# EAGLE design Remote Control v1 (EAGLE 6.5.0)
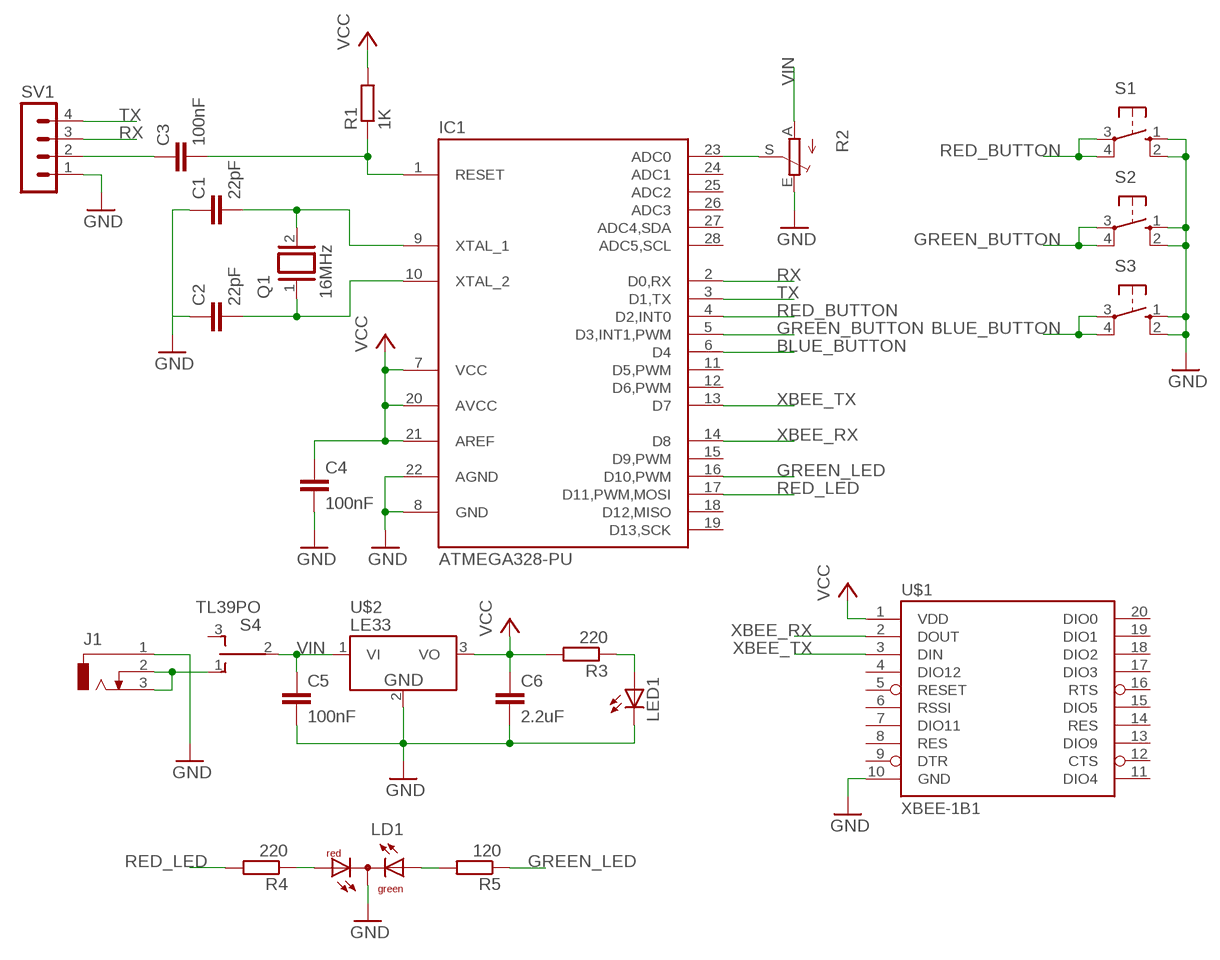
[diagram p0: schematic, sheet 1]

## Parts
C1  22pF  C-EU050-024X044  [C050-024X044]
C2  22pF  C-EU050-024X044  [C050-024X044]
C3  100nF  C-EU050-025X075  [C050-025X075]
C4  100nF  C-EU050-025X075  [C050-025X075]
C5  100nF  C-EU050-025X075  [C050-025X075]
C6  2.2uF  C-EU050-035X075  [C050-035X075]
IC1  ATMEGA328-PU  [DIL28-3]
J1  DCJ0303  [DCJ0303]
LD1  DUOLED-RG-C  [DUOLED-C-5MM]
LED1  LED3MM  [LED3MM]
Q1  16MHz  XTAL/S  [QS]
R1  1K  R-EU_0207/7  [0207/7]
R2  TRIM_EU-CA9V  [CA9V]
R3  220  R-EU_0207/7  [0207/7]
R4  220  R-EU_0207/7  [0207/7]
R5  120  R-EU_0207/7  [0207/7]
S1  40-XX  [B3F-40XX]
S2  40-XX  [B3F-40XX]
S3  40-XX  [B3F-40XX]
S4  TL39PO  [TL3XPO]
SV1  MA04-1  [MA04-1]
U$1  XBEE-1B1  [XBEE-1]
U$2  LE33  [TO-92]

## Nets
BLUE_BUTTON: IC1.6(D4) S3.3(P) S3.4(P1)
GND: C1.1 C2.1 C4.2 C5.2 C6.2 IC1.8(GND) IC1.22(AGND) J1.1 LD1.C LED1.K(C) R2.E S1.1(S) S1.2(S1) S2.1(S) S2.2(S1) S3.1(S) S3.2(S1) SV1.1 U$1.10(GND) U$2.2(GND)
GREEN_BUTTON: IC1.5(D3,INT1,PWM) S2.3(P) S2.4(P1)
GREEN_LED: IC1.16(D10,PWM) R5.1
N$1: C1.2 IC1.9(XTAL_1) Q1.2
N$2: C2.2 IC1.10(XTAL_2) Q1.1
N$3: J1.2 J1.3 S4.1(O)
N$5: C3.2 IC1.1(RESET) R1.1
N$6: C3.1 SV1.2
N$9: IC1.23(ADC0) R2.S
N$10: LED1.A R3.1
N$11: LD1.AR R4.1
N$12: LD1.AX(AG) R5.2
RED_BUTTON: IC1.4(D2,INT0) S1.3(P) S1.4(P1)
RED_LED: IC1.17(D11,PWM,MOSI) R4.2
RX: IC1.2(D0,RX) SV1.3
TX: IC1.3(D1,TX) SV1.4
VCC: C4.1 C6.1 IC1.7(VCC) IC1.20(AVCC) IC1.21(AREF) R1.2 R3.2 U$1.1(VDD) U$2.3(VO)
VIN: C5.1 R2.A S4.2(P) U$2.1(VI)
XBEE_RX: IC1.14(D8) U$1.2(DOUT)
XBEE_TX: IC1.13(D7) U$1.3(DIN)
Unconnected: IC1.11(D5,PWM) IC1.12(D6,PWM) IC1.15(D9,PWM) IC1.18(D12,MISO) IC1.19(D13,SCK) IC1.24(ADC1) IC1.25(ADC2) IC1.26(ADC3) IC1.27(ADC4,SDA) IC1.28(ADC5,SCL) S4.3(S) U$1.4(DIO12) U$1.5(RESET) U$1.6(RSSI) U$1.7(DIO11) U$1.8(RES) U$1.9(DTR) U$1.11(DIO4) U$1.12(CTS) U$1.13(DIO9) U$1.14(RES) U$1.15(DIO5) U$1.16(RTS) U$1.17(DIO3) U$1.18(DIO2) U$1.19(DIO1) U$1.20(DIO0)

## Library data of the parts
C1-C6 = resistor:C-EU: CAPACITOR, European symbol
IC1 = Arduino:ATMEGA328-PU
J1 = con-jack:DCJ0303: DC POWER JACK Source: DCJ0303.pdf; OC_FARNELL: unknown; OC_NEWARK: unknown
LD1 = led:DUOLED-RG-C: DUO LED 2 colors (red/green), 5 mm, round, common Cathode www.ligitek.com or other producers.
LED1 = led:LED: LED OSRAM: - CHIPLED LG R971, LG N971, LY N971, LG Q971, LY Q971, LO R971, LY R971 LH N974, LH R974 LS Q976, LO Q976, LY Q976 LO Q996 - Hyper CHIPLED LW Q18S LB Q993, LB Q99A, LB R99A - SideLED LS A670, LO A670, LY A670, LG A670, LP A670 LB A673, LV A673, LT A673, LW A673 LH A674 LY A675 LS A676, LA A676, LO A676, LY A676, LW A676 LS A679, LY A679, LG A679 - Hyper Micro SIDELED® LS Y876, LA Y876, LO Y876, LY Y876 LT Y87S - SmartLED LW L88C, LW L88S LB L89C, LB L89S, LG L890 LS L89K, LO L89K, LY L89K LS L896, LA L896, LO L896, LY L896 - TOPLED LS T670, LO T670, LY T670, LG T670, LP T670 LSG T670, LSP T670, LSY T670, LOP T670, LYG T670 LG T671, LOG T671, LSG T671 LB T673, LV T673, LT T673, LW T673 LH T674 LS T676, LA T676, LO T676, LY T676, LB T676, LH T676, LSB T676, LW T676 LB T67C, LV T67C, LT T67C, LS T67K, LO T67K, LY T67K, LW E67C LS E67B, LA E67B, LO E67B, LY E67B, LB E67C, LV E67C, LT E67C LW T67C LS T679, LY T679, LG T679 LS T770, LO T770, LY T770, LG T770, LP T770 LB T773, LV T773, LT T773, LW T773 LH T774 LS E675, LA E675, LY E675, LS T675 LS T776, LA T776, LO T776, LY T776, LB T776 LHGB T686 LT T68C, LB T68C - Hyper Mini TOPLED® LB M676 - Mini TOPLED Santana® LG M470 LS M47K, LO M47K, LY M47K Source: http://www.osram.convergy.de LUXEON: - LUMILED® LXK2-PW12-R00, LXK2-PW12-S00, LXK2-PW14-U00, LXK2-PW14-V00 LXK2-PM12-R00, LXK2-PM12-S00, LXK2-PM14-U00 LXK2-PE12-Q00, LXK2-PE12-R00, LXK2-PE12-S00, LXK2-PE14-T00, LXK2-PE14-U00 LXK2-PB12-K00, LXK2-PB12-L00, LXK2-PB12-M00, LXK2-PB14-N00, LXK2-PB14-P00, LXK2-PB14-Q00 LXK2-PR12-L00, LXK2-PR12-M00, LXK2-PR14-Q00, LXK2-PR14-R00 LXK2-PD12-Q00, LXK2-PD12-R00, LXK2-PD12-S00 LXK2-PH12-R00, LXK2-PH12-S00 LXK2-PL12-P00, LXK2-PL12-Q00, LXK2-PL12-R00 Source: www.luxeon.com KINGBRIGHT: KA-3528ASYC Source: www.kingbright.com
Q1 = special:XTAL/S: CRYSTAL
R1 R3-R5 = resistor:R-EU_: RESISTOR, European symbol
R2 = pot:TRIM_EU-: POTENTIOMETER
S1-S3 = switch-omron:40-XX: OMRON SWITCH; MF: OMRON COMPONENTS USA; MPN: B3F-4000; OC_FARNELL: 176434; OC_NEWARK: 36K3105
S4 = switch:TL39PO: TINY SWITCH ON OFF ON Source: http://www2.produktinfo.conrad.com/datenblaetter/700000-724999/705152-da-01-de-Subminiaturschalter_TL_36YO.pdf
SV1 = con-lstb:MA04-1: PIN HEADER; OC_FARNELL: unknown; OC_NEWARK: unknown
U$1 = Xbee:XBEE-1: Xbee module footprints SMT header is CONN-09042.
U$2 = Regulator:LE33

## Board
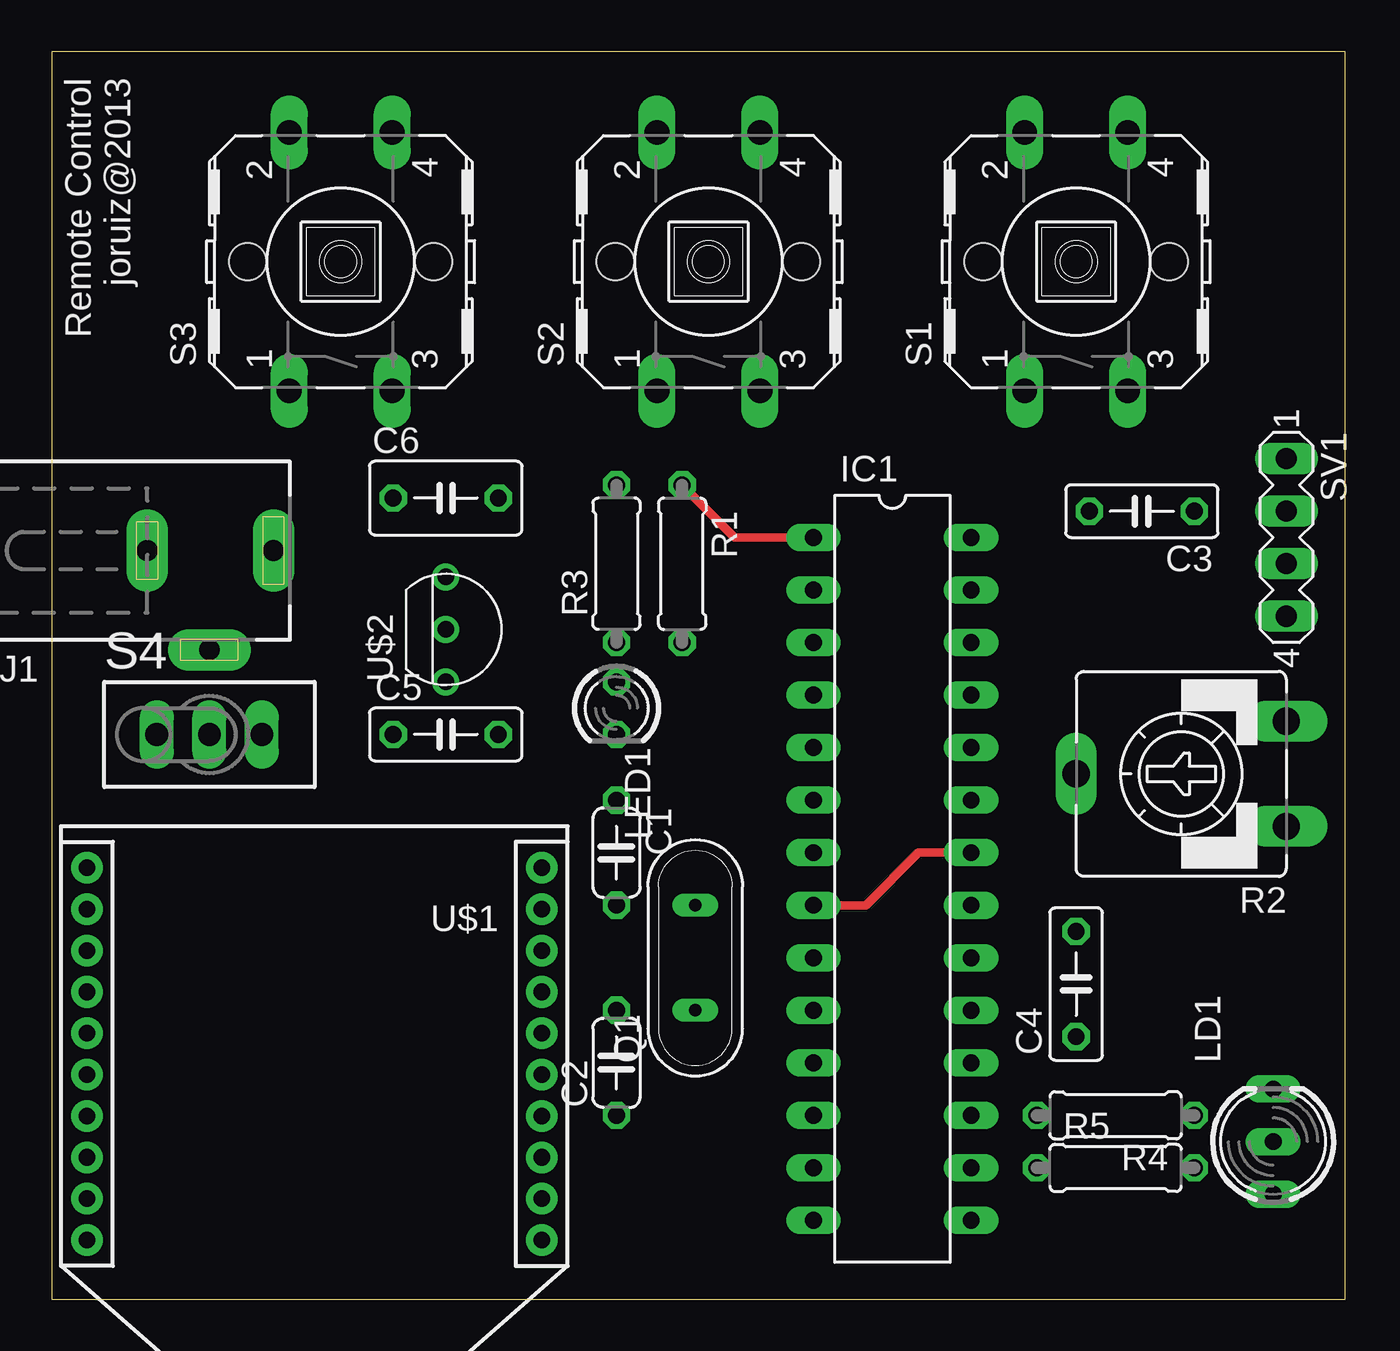
[diagram p1: board, top side]
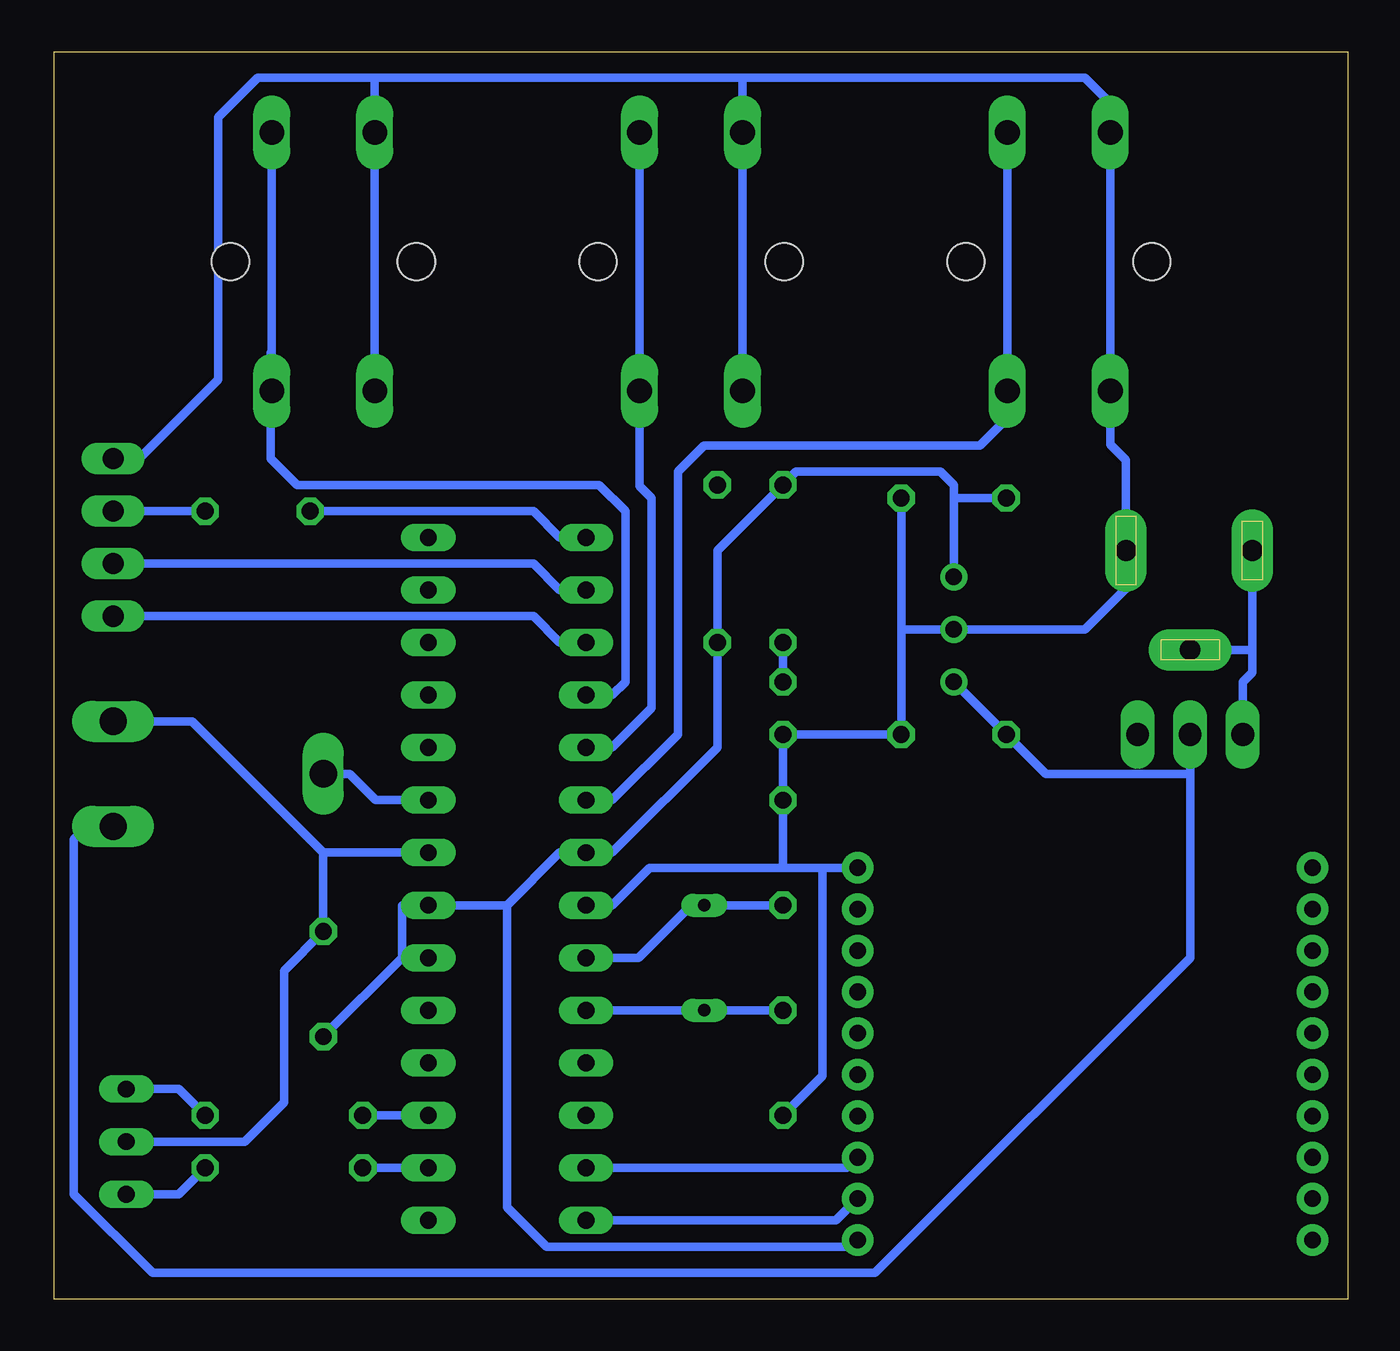
[diagram p2: board, bottom side, seen from below]

Size 62.53 x 60.31 mm. Coordinates in mm from the lower left corner, seen from the top.
Outline: 0,0 62.53,0 62.53,60.31 0,60.31 0,0
Copper layers (1*16): Top 0.035mm / dielectric 1.5mm / Bottom 0.035mm
Design rules "default": minimum track width 10mil, minimum drill 24mil, track to track 8mil, track to pad 8mil, pad to pad 8mil, via to via 8mil, smd to smd 8mil, copper to edge 40mil, drill to drill 8mil, minimum pad ring 10mil, minimum via ring 8mil, stop-mask expansion 4mil, vias tented up to drill 0mil, thermal gap 10mil

### Footprints (pad centres in the part's own frame; a part is rotated, then mirrored left to right if it is on the bottom)
C050-024X044 = drill 0.813 octagon: 1 -2.54,0; 2 2.54,0
C050-025X075 = drill 0.813 octagon: 1 -2.54,0; 2 2.54,0
C050-035X075 = drill 0.813 octagon: 1 -2.54,0; 2 2.54,0
DIL28-3 = drill 0.813 long: 1 -16.51,-3.81; 2 -13.97,-3.81; 3 -11.43,-3.81; 4 -8.89,-3.81; 5 -6.35,-3.81; 6 -3.81,-3.81; 7 -1.27,-3.81; 8 1.27,-3.81; 9 3.81,-3.81; 10 6.35,-3.81; 11 8.89,-3.81; 12 11.43,-3.81; 13 13.97,-3.81; 14 16.51,-3.81; 15 16.51,3.81; 16 13.97,3.81; 17 11.43,3.81; 18 8.89,3.81; 19 6.35,3.81; 20 3.81,3.81; 21 1.27,3.81; 22 -1.27,3.81; 23 -3.81,3.81; 24 -6.35,3.81; 25 -8.89,3.81; 26 -11.43,3.81; 27 -13.97,3.81; 28 -16.51,3.81
DCJ0303 = drill 1 pad 2 long: 1 0,3.1; 2 4.8,0; 3 0,-3
DUOLED-C-5MM = drill 0.813 long: AR 2.54,0; AX -2.54,0; C 0,0
LED3MM = drill 0.813 octagon: A -1.27,0; K 1.27,0
QS = drill 0.61 long: 1 -2.54,0; 2 2.54,0
0207/7 = drill 0.813 octagon: 1 -3.81,0; 2 3.81,0
CA9V = drill 1.321 long: A -2.54,-5.08; E 2.54,-5.08; S 0,5.08
B3F-40XX = drill 1.194 long: 1 -6.248,2.489; 2 6.248,2.489; 3 -6.248,-2.489; 4 6.248,-2.489 | hole 1.803: 0,-4.496; 0,4.496
TL3XPO = drill 1.1 pad 1.422 long: 1 -2.54,0; 2 0,0; 3 2.54,0
MA04-1 = drill 1.016 long: 1 -3.81,0; 2 -1.27,0; 3 1.27,0; 4 3.81,0
XBEE-1 = drill 0.8 pad 1.524: 1 -11,20; 2 -11,18; 3 -11,16; 4 -11,14; 5 -11,12; 6 -11,10; 7 -11,8; 8 -11,6; 9 -11,4; 10 -11,2; 11 11,2; 12 11,4; 13 11,6; 14 11,8; 15 11,10; 16 11,12; 17 11,14; 18 11,16; 19 11,18; 20 11,20
TO-92 = drill 0.8: 1 -2.54,0; 2 0,0; 3 2.54,0

### Placement (x,y rotation side)
C1  27.3,21.59 270 top
C2  27.3,11.43 90 top
C3  52.7,38.1 180 top
C4  49.53,15.24 90 top
C5  19.05,27.3 0 top
C6  19.05,38.73 0 top
IC1  40.64,20.32 270 top
J1  7.62,36.2 270 top
LD1  59.05,7.62 90 top
LED1  27.3,28.57 270 top
Q1  31.11,16.51 90 top
R1  30.48,35.56 270 top
R2  54.61,25.4 90 top
R3  27.3,35.56 90 top
R4  51.44,8.89 180 top
R5  51.44,6.35 0 top
S1  49.53,50.16 90 top
S2  31.75,50.16 90 top
S3  13.97,50.16 90 top
S4  7.62,27.3 0 top
SV1  59.69,36.83 270 top
U$1  12.7,22.86 180 top
U$2  19.05,32.38 90 top

### Tracks (layer width: path | path; a pad name or v marks a point on that pad's centre or on a via)
BLUE_BUTTON
  Bottom 0.406: IC1.6 35.56,24.13 32.38,27.3 32.38,40.01 31.11,41.27 20.95,41.27 19.68,41.27 17.78,41.27 16.46,42.6 S3.3 S3.4
GND
  Top 0.406: IC1.22 41.91,21.59 39.37,19.05 IC1.8
  Bottom 0.406: 29.26,59.05 12.7,59.05 11.48,57.84 S3.2 S3.1 11.48,41.33 10.72,40.56 J1.1 10.72,34.37 12.7,32.38 U$2.2 21.59,32.38 | 29.26,59.05 47.04,59.05 | 47.04,59.05 52.7,59.05 54.61,57.15 54.61,44.45 58.42,40.64 SV1.1 | 47.04,59.05 S1.2 S1.1 | 29.26,59.05 S2.2 S2.1 | C6.2 21.59,32.38 | 21.59,32.38 C5.2 LED1.K C1.1 27.3,20.86 | 25.4,20.86 25.4,10.79 C2.1 | U$1.10 25.4,20.86 | 25.4,20.86 27.3,20.86 | 27.3,20.86 33.75,20.86 35.56,19.05 IC1.8 | IC1.22 49.53,21.59 | 49.53,21.59 55.88,27.94 R2.E | 49.53,21.59 C4.2 51.44,15.88 51.44,9.53 53.34,7.62 LD1.C
GREEN_BUTTON
  Bottom 0.406: S2.4 S2.3 34.24,39.32 33.66,38.73 33.66,28.57 35.56,26.67 IC1.5
GREEN_LED
  Bottom 0.406: IC1.16 R5.1
N$1
  Bottom 0.406: IC1.9 34.29,16.51 31.75,19.05 Q1.2 C1.2
N$2
  Bottom 0.406: IC1.10 Q1.1 C2.2
N$3
  Bottom 0.406: J1.3 4.62,31.39 | 4.62,31.39 4.62,30.3 5.08,29.84 S4.1 | J1.2 4.62,31.39
N$5
  Top 0.406: IC1.1 33.02,36.83 R1.1
  Bottom 0.406: C3.2 39.37,38.1 38.1,36.83 IC1.1
N$6
  Bottom 0.406: SV1.2 C3.1
N$9
  Bottom 0.406: IC1.23 46.99,24.13 48.26,25.4 R2.S
N$10
  Bottom 0.406: R3.1 LED1.A
N$11
  Bottom 0.406: R4.1 56.52,10.16 LD1.AR
N$12
  Bottom 0.406: R5.2 56.52,5.08 LD1.AX
RED_BUTTON
  Bottom 0.406: S1.4 S1.3 52.07,45.77 52.07,40.64 50.8,39.37 36.2,39.37 34.92,38.1 34.92,29.84 35.56,29.21 IC1.4
RED_LED
  Bottom 0.406: IC1.17 R4.2
RX
  Bottom 0.406: SV1.3 39.37,35.56 38.1,34.29 IC1.2
TX
  Bottom 0.406: SV1.4 39.37,33.02 38.1,31.75 IC1.3
VCC
  Bottom 0.406: IC1.20 45.72,16.51 | 45.72,16.51 C4.1 | 45.72,16.51 45.72,19.05 IC1.21 40.64,19.05 | U$2.3 19.05,38.73 | 19.05,38.73 C6.1 | U$1.1 24.02,2.54 38.73,2.54 40.64,4.45 40.64,19.05 | 19.05,38.73 19.05,39.37 19.68,40.01 26.67,40.01 R3.2 30.48,36.2 R1.2 30.48,26.67 35.56,21.59 IC1.7 38.1,21.59 40.64,19.05
VIN
  Bottom 0.406: S4.2 7.62,25.4 | 7.62,25.4 7.62,16.51 22.86,1.27 57.78,1.27 61.59,5.08 61.59,22.23 60.96,22.86 R2.A | 7.62,25.4 14.61,25.4 C5.1 U$2.1
XBEE_RX
  Bottom 0.406: U$1.2 24.75,3.81 IC1.14
XBEE_TX
  Bottom 0.406: U$1.3 24.21,6.35 IC1.13

### Text on the board
tNames: Remote Control / joruiz@2013